# EAGLE schematic prototipo_receptor_same (EAGLE 9.3.2)
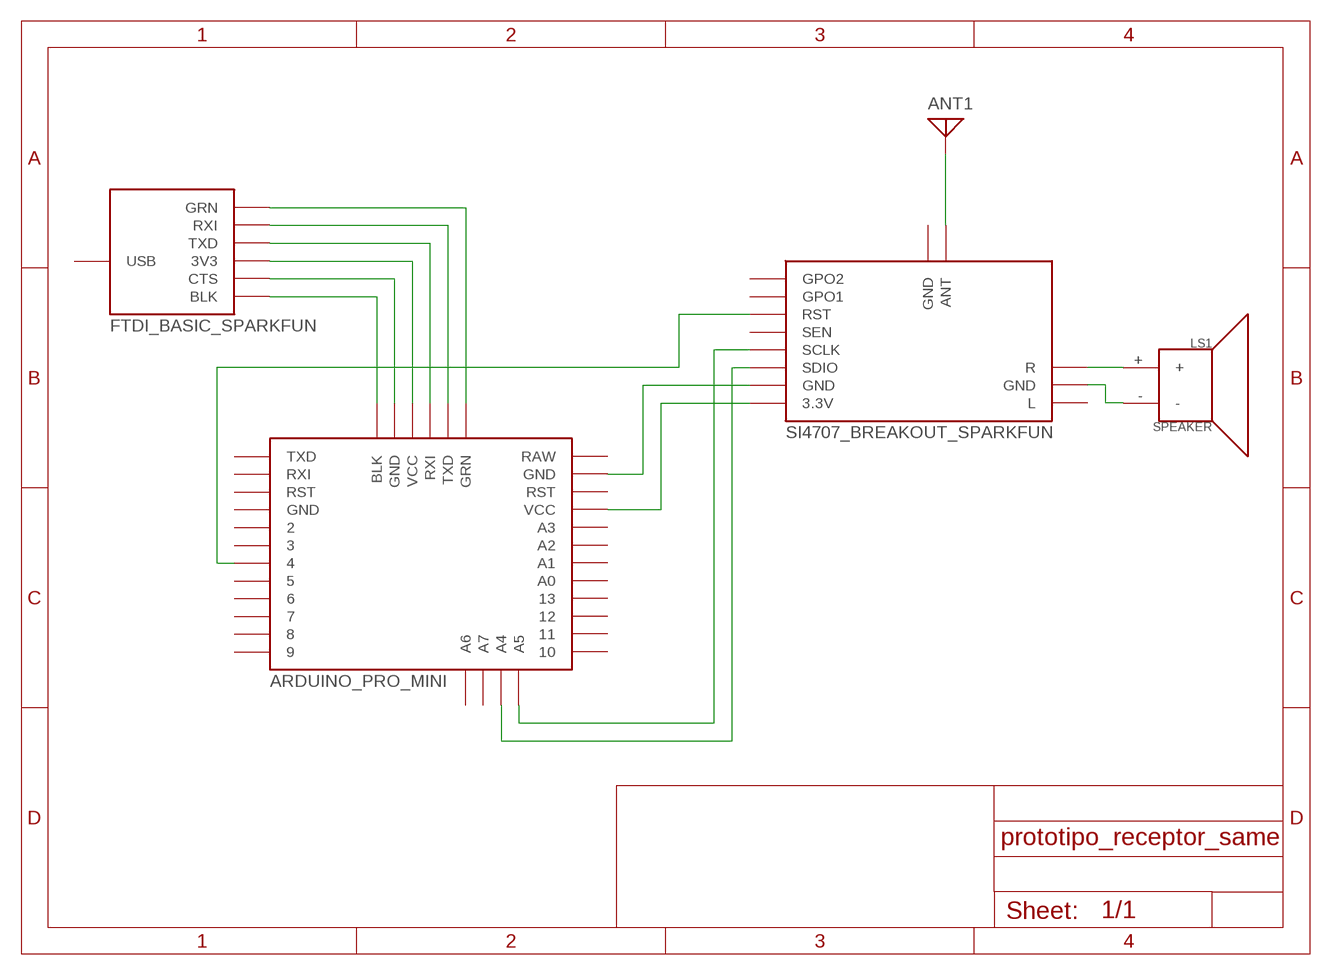
[diagram p0: schematic, sheet 1]

## Parts
ANT1  ANTENNA  [PAD-01]
B1  SI4707_BREAKOUT_SPARKFUN  (no package)
B2  ARDUINO_PRO_MINI  (no package)
B3  FTDI_BASIC_SPARKFUN  (no package)
LS1  SPEAKER  [PCB_MOUNT_SPEAKER]

## Nets
N$1: B2.BLK B3.BLK
N$2: B2.GND B3.CTS
N$3: B2.VCC B3.3V3
N$4: B2.RXI B3.TXD
N$5: B2.TXD B3.RXI
N$6: B2.GRN B3.GRN
N$7: B1.GND LS1.-
N$8: B1.R LS1.+
N$9: ANT1.1 B1.ANT
N$10: B1.3.3V B2.VCC
N$11: B1.GND B2.GND
N$12: B1.SCLK B2.A5
N$13: B1.SDIO B2.A4
N$14: B1.RST B2.4
Unconnected: B1.GND B1.GPO1 B1.GPO2 B1.L B1.SEN B2.2 B2.3 B2.5 B2.6 B2.7 B2.8 B2.9 B2.10 B2.11 B2.12 B2.13 B2.A0 B2.A1 B2.A2 B2.A3 B2.A6 B2.A7 B2.GND B2.RAW B2.RST B2.RXI B2.TXD B3.USB

## Library data of the parts
ANT1 = discrete:ANTENNA: Antenna
B1 = prototipo_receptor_same:SI4707_BREAKOUT_SPARKFUN
B2 = prototipo_receptor_same:ARDUINO_PRO_MINI
B3 = prototipo_receptor_same:FTDI_BASIC_SPARKFUN
LS1 = SparkFun-Electromechanical:SPEAKER: Speaker Generic 2-terminal loudspeakers SparkFun Products Speaker - PCB Mount <https://www.sparkfun.com/products/11089> (COM-11089); PROD_ID: COMP-11789; SF_SKU: COM-11089